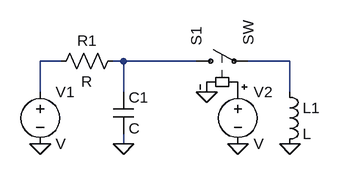
[diagram p0: schematic Draft2.asc]
Draft2.asc, the LTspice schematic file:
Version 4
SHEET 1 880 680
WIRE -112 128 -144 128
WIRE -16 128 -32 128
WIRE 96 128 -16 128
WIRE 240 128 176 128
WIRE -144 176 -144 128
WIRE -16 176 -16 128
WIRE 240 176 240 128
WIRE -16 256 -16 240
FLAG -16 256 0
FLAG -144 256 0
FLAG 240 256 0
FLAG 112 176 0
FLAG 160 256 0
SYMBOL cap -32 176 R0
SYMATTR InstName C1
SYMBOL voltage -144 160 R0
SYMATTR InstName V1
SYMBOL ind 224 160 R0
SYMATTR InstName L1
SYMBOL sw 80 128 R270
SYMATTR InstName S1
SYMBOL res -16 112 R90
WINDOW 0 0 56 VBottom 2
WINDOW 3 32 56 VTop 2
SYMATTR InstName R1
SYMBOL voltage 160 160 R0
SYMATTR InstName V2

The netlist it stands for:
* Draft2.asc
C1 N002 0 C
V1 N001 0 V
L1 N003 0 L
S1 N002 N003 P001 0 SW
R1 N002 N001 R
V2 P001 0 V
.backanno
.end